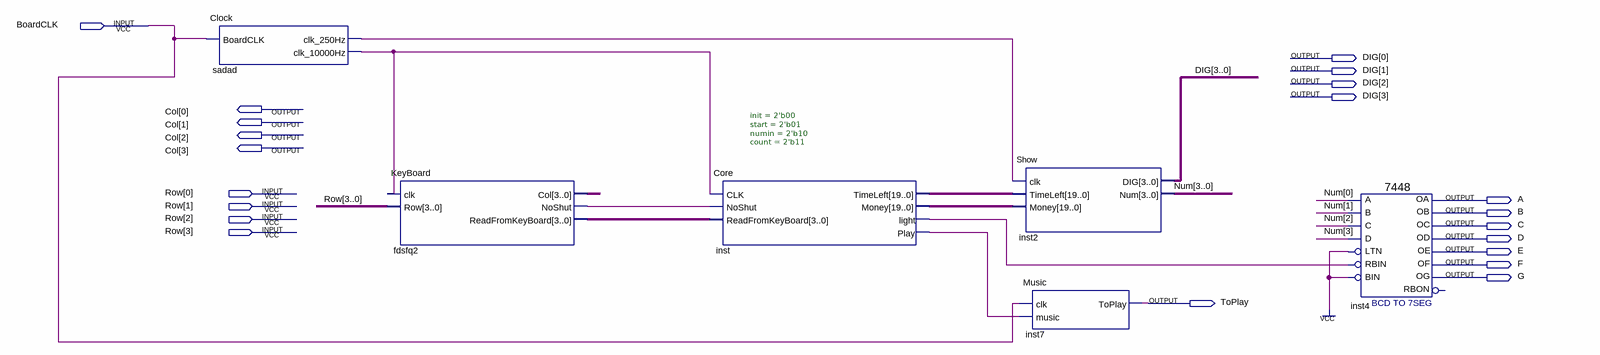
[diagram p0: schematic sheet]
// Quartus schematic Final.bdf as structural Verilog: 6 symbols, 21 pins
module Final (
  input  BoardCLK,
  input  [3:0] Row,
  output [3:0] DIG,
  output [3:0] Col,
  output A,
  output B,
  output C,
  output D,
  output E,
  output F,
  output G,
  output ToPlay
);

  wire fdsfq2_noshut, inst_light, inst_play, sadad_clk_250hz, sadad_clk_10000hz;
  wire [3:0] fdsfq2_col, fdsfq2_readfromkeyboard, Num;
  wire [19:0] inst_money, inst_timeleft;

  Clock sadad (.BoardCLK(BoardCLK), .clk_250Hz(sadad_clk_250hz), .clk_10000Hz(sadad_clk_10000hz));
  KeyBoard fdsfq2 (
    .clk(sadad_clk_10000hz), .Row(Row), .Col(fdsfq2_col), .NoShut(fdsfq2_noshut),
    .ReadFromKeyBoard(fdsfq2_readfromkeyboard));
  Core #(.init(2'b00), .start(2'b01), .numin(2'b10), .count(2'b11)) inst (
    .CLK(sadad_clk_10000hz), .NoShut(fdsfq2_noshut), .ReadFromKeyBoard(fdsfq2_readfromkeyboard),
    .TimeLeft(inst_timeleft), .Money(inst_money), .light(inst_light), .Play(inst_play));
  Show inst2 (.clk(sadad_clk_250hz), .TimeLeft(inst_timeleft), .Money(inst_money), .DIG(DIG), .Num(Num));
  Music inst7 (.clk(BoardCLK), .music(inst_play), .ToPlay(ToPlay));
  \7448  inst4 (
    .A(Num[0]), .C(Num[2]), .D(Num[3]), .B(Num[1]), .RBIN(inst_light), .BIN(1'b1), .LTN(1'b1), .OC(C),
    .OE(E), .OD(D), .OF(F), .OG(G), .OB(B), .OA(A));  // open: RBON
endmodule
